# EAGLE schematic M_H_ext_rgb (EAGLE 9.6.2)
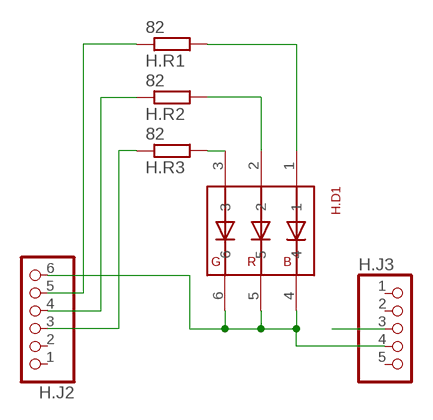
[diagram p0: schematic, sheet 1]

## Parts
H.D1  RGB_WW-FCE50TC-Q1  [RGB_WW-FCE50TC-Q1]
H.J2  PINHD-1X6  [1X06]
H.J3  PINHD-1X5  [1X05]
H.R1  82  R-EU_R0603  [R0603]
H.R2  82  R-EU_R0603  [R0603]
H.R3  82  R-EU_R0603  [R0603]

## Nets
GND: H.D1.4 H.D1.5 H.D1.6 H.J2.6 H.J3.4
N$1: H.D1.1 H.R1.2
N$2: H.D1.3 H.R3.2
N$3: H.D1.2 H.R2.2
N$4: H.J2.5 H.R1.1
N$5: H.J2.4 H.R2.1
N$6: H.J2.3 H.R3.1
VDD: H.J3.3
Unconnected: H.J2.1 H.J2.2 H.J3.1 H.J3.2 H.J3.5

## Library data of the parts
H.D1 = hugo:RGB_WW-FCE50TC-Q1
H.J2 = pinhead2:PINHD-1X6: PIN HEADER
H.J3 = pinhead2:PINHD-1X5: PIN HEADER
H.R1-H.R3 = resistor:R-EU_: RESISTOR, European symbol